# EAGLE design LDA_Board (EAGLE 7.6.0)
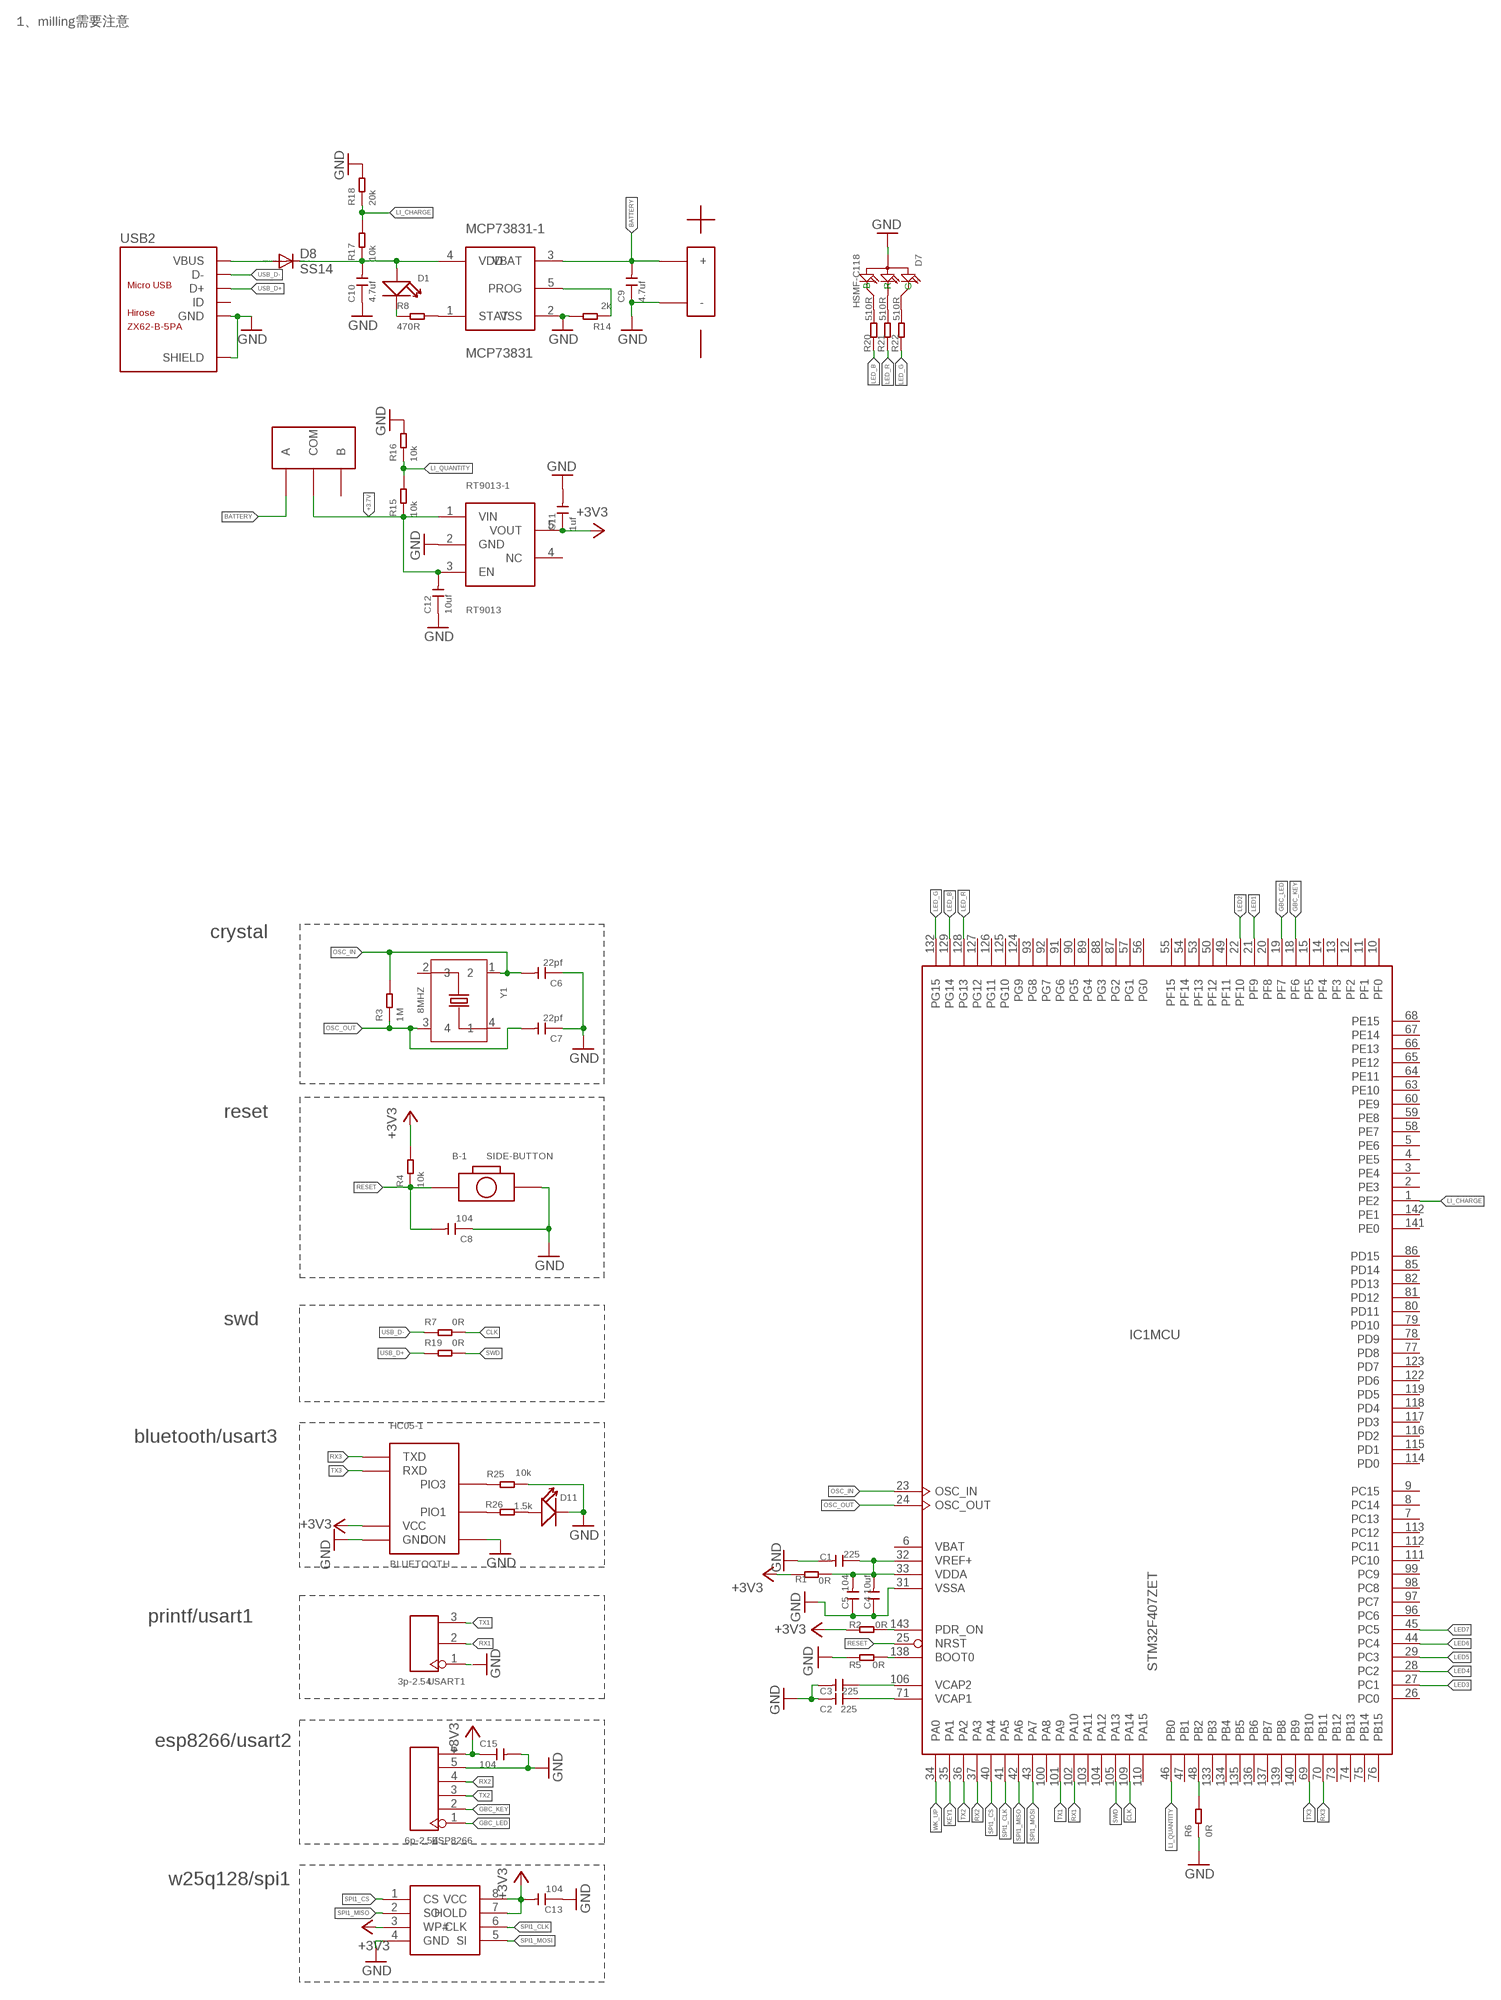
[diagram p0: schematic, sheet 1, part 1 of 2]
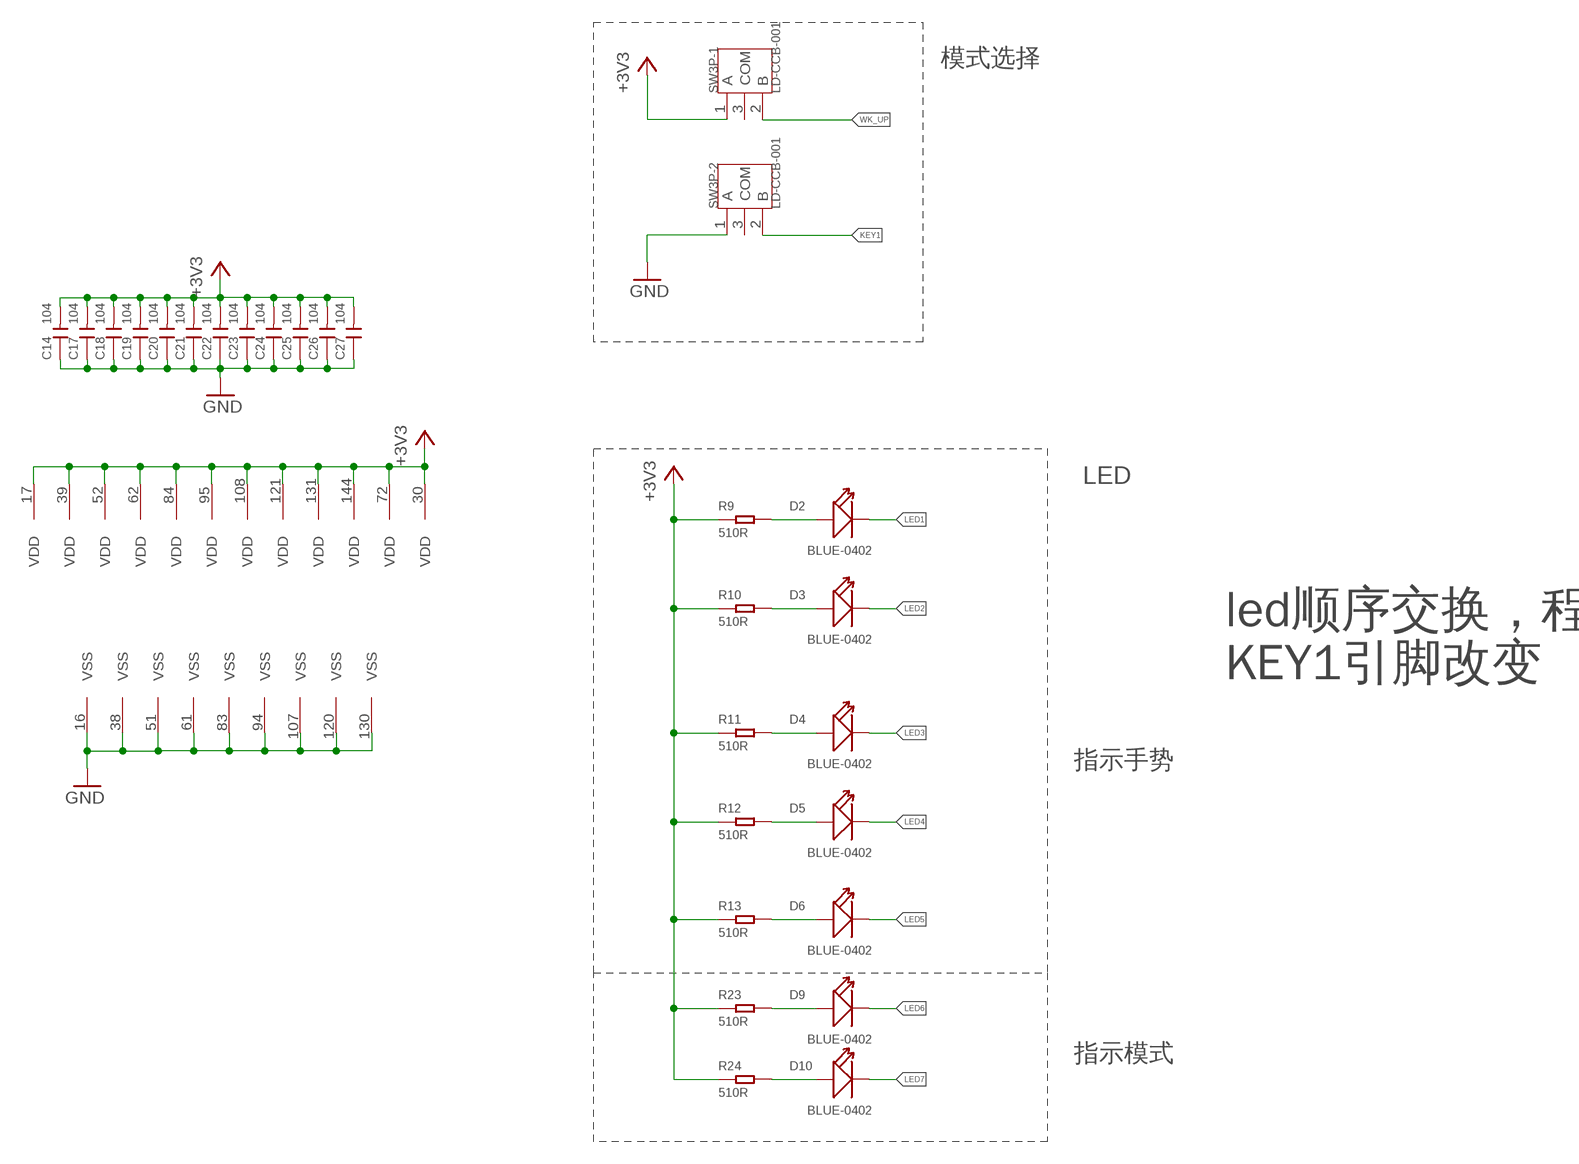
[diagram p1: schematic, sheet 1, part 2 of 2]

## Parts
B-1  SIDE-BUTTON  [SIDE-BUTTON]
BATTERY-1  BATTERY  [BATTERY]
C1  225  CAP-(0402)  [C0402]
C2  225  CAP-(0402)  [C0402]
C3  225  CAP-(0402)  [C0402]
C4  10uf  CAP-(0402)  [C0402]
C5  104  CAP-(0402)  [C0402]
C6  22pf  CAP-(0402)  [C0402]
C7  22pf  CAP-(0402)  [C0402]
C8  104  CAP-(0402)  [C0402]
C9  4.7uf  CAP-(0402)  [C0402]
C10  4.7uf  CAP-(0402)  [C0402]
C11  1uf  CAP-(0402)  [C0402]
C12  10uf  CAP-(0402)  [C0402]
C13  104  CAP-(0402)  [C0402]
C14  104  CAP-(0402)  [C0402]
C15  104  CAP-(0402)  [C0402]
C17  104  CAP-(0402)  [C0402]
C18  104  CAP-(0402)  [C0402]
C19  104  CAP-(0402)  [C0402]
C20  104  CAP-(0402)  [C0402]
C21  104  CAP-(0402)  [C0402]
C22  104  CAP-(0402)  [C0402]
C23  104  CAP-(0402)  [C0402]
C24  104  CAP-(0402)  [C0402]
C25  104  CAP-(0402)  [C0402]
C26  104  CAP-(0402)  [C0402]
C27  104  CAP-(0402)  [C0402]
D1  BLUE-0402  LED-(0402)  [LED-0402]
D2  BLUE-0402  LED-(0402)  [LED-0402]
D3  BLUE-0402  LED-(0402)  [LED-0402]
D4  BLUE-0402  LED-(0402)  [LED-0402]
D5  BLUE-0402  LED-(0402)  [LED-0402]
D6  BLUE-0402  LED-(0402)  [LED-0402]
D7  HSMF-C118  SMD-LED-RGB(4P-1210)  [LED4-SMD-1210]
D8  SS14  [SMA]
D9  BLUE-0402  LED-(0402)  [LED-0402]
D10  BLUE-0402  LED-(0402)  [LED-0402]
D11  BLUE-0402  LED-(0402)  [LED-0402]
ESP8266  6p-2.54  DIP-BLACK-FEMALE-HEADER-VERT(6P-2.54)  [H6-2.54]
HC05-1  BLUETOOTH  [BLUETOOTH]
IC1  STM32F407ZET  [LQFP144]
MCP73831-1  MCP73831  [SOT23-5]
R1  0R  RES-(0402)  [R0402]
R2  0R  RES-(0402)  [R0402]
R3  1M  RES-(0402)  [R0402]
R4  10k  RES-(0402)  [R0402]
R5  0R  RES-(0402)  [R0402]
R6  0R  RES-(0402)  [R0402]
R7  0R  RES-(0402)  [R0402]
R8  470R  RES-(0402)  [R0402]
R9  510R  RES-(0402)  [R0402]
R10  510R  RES-(0402)  [R0402]
R11  510R  RES-(0402)  [R0402]
R12  510R  RES-(0402)  [R0402]
R13  510R  RES-(0402)  [R0402]
R14  2k  RES-(0402)  [R0402]
R15  10k  RES-(0402)  [R0402]
R16  10k  RES-(0402)  [R0402]
R17  10k  RES-(0402)  [R0402]
R18  20k  RES-(0402)  [R0402]
R19  0R  RES-(0402)  [R0402]
R20  510R  RES-(0402)  [R0402]
R21  510R  RES-(0402)  [R0402]
R22  510R  RES-(0402)  [R0402]
R23  510R  RES-(0402)  [R0402]
R24  510R  RES-(0402)  [R0402]
R25  10k  RES-(0402)  [R0402]
R26  1.5k  RES-(0402)  [R0402]
RT9013-1  RT9013  [SOT23-5]
SW3P-1  LD-CCB-001  SWITCH(3P)  [SW3-2.54-9.0X3.5X3.5+2.0MM]
SW3P-2  LD-CCB-001  SWITCH(3P)  [SW3-2.54-9.0X3.5X3.5+2.0MM]
SW-1  SWITCH-3P  [SWITCH-3P]
USART1  3p-2.54  DIP-BLACK-FEMALE-HEADER-VERT(3P-2.54)  [H3-2.54]
USB2  ZX62-B-5PA  MICRO-USB-SMD(ZX62-B-5PA)  [MICRO-USB5+6P-SMD-0.65-AB]
W25Q128  W25Q128  [SOP08]
Y1  8MHZ  SMD-CRYSTAL-27.12MHZ-18PF-30PPM-60R(4P-3.2X2.5MM)  [X4-SMD-3.2X2.5X0.7MM]

## Nets
+3.7V: C12.2 R15.1 RT9013-1.1(VIN) RT9013-1.3(EN) SW-1.P$2(COM)
+3V3: C11.1 C13.2 C14.2 C15.1 C17.2 C18.2 C19.2 C20.2 C21.2 C22.2 C23.2 C24.2 C25.2 C26.2 C27.2 ESP8266.6 HC05-1.P$12(VCC) IC1.17(PWR:VDD) IC1.30(PWR:VDD) IC1.39(PWR:VDD) IC1.52(PWR:VDD) IC1.62(PWR:VDD) IC1.72(PWR:VDD) IC1.84(PWR:VDD) IC1.95(PWR:VDD) IC1.108(PWR:VDD) IC1.121(PWR:VDD) IC1.131(PWR:VDD) IC1.144(PWR:VDD) R1.1 R2.1 R4.2 R9.1 R10.1 R11.1 R12.1 R13.1 R23.1 R24.1 RT9013-1.5(VOUT) SW3P-1.1(A) W25Q128.3(WP#) W25Q128.7(HOLD) W25Q128.8(VCC)
+5V: C10.2 D1.+ D8.C MCP73831-1.4(VDD) R17.1
BATTERY: BATTERY-1.P$1(+) C9.2 MCP73831-1.3(VBAT) SW-1.P$3(A)
CLK: IC1.109(MCU:PA14) R7.2
GBC_KEY: ESP8266.2 IC1.18(MCU:PF6)
GBC_LED: ESP8266.1 IC1.19(MCU:PF7)
GND: B-1.P$1 BATTERY-1.P$2(-) C1.2 C2.2 C3.2 C4.1 C5.1 C6.1 C7.1 C8.1 C9.1 C10.1 C11.2 C12.1 C13.1 C14.1 C15.2 C17.1 C18.1 C19.1 C20.1 C21.1 C22.1 C23.1 C24.1 C25.1 C26.1 C27.1 D7.1(+) D11.- ESP8266.5 HC05-1.P$13(GND) HC05-1.P$22(CON) IC1.16(PWR:VSS) IC1.31(MCU:VSSA) IC1.38(PWR:VSS) IC1.51(PWR:VSS) IC1.61(PWR:VSS) IC1.83(PWR:VSS) IC1.94(PWR:VSS) IC1.107(PWR:VSS) IC1.120(PWR:VSS) IC1.130(PWR:VSS) MCP73831-1.2(VSS) R5.1 R6.1 R14.2 R16.2 R18.2 R25.2 RT9013-1.2(GND) SW3P-2.1(A) USART1.1 USB2.5(GND) USB2.P1(SHIELD) USB2.P2(SHIELD) USB2.P3(SHIELD) USB2.P4(SHIELD) USB2.P5(SHIELD) USB2.P6(SHIELD) W25Q128.4(GND)
KEY1: IC1.35(MCU:PA1) SW3P-2.2(B)
LED1: D2.- IC1.21(MCU:PF9)
LED2: D3.- IC1.22(MCU:PF10)
LED3: D4.- IC1.27(MCU:PC1)
LED4: D5.- IC1.28(MCU:PC2)
LED5: D6.- IC1.29(MCU:PC3)
LED6: D9.- IC1.44(MCU:PC4)
LED7: D10.- IC1.45(MCU:PC5)
LED_B: IC1.129(MCU:PG14) R20.1
LED_G: IC1.132(MCU:PG15) R22.1
LED_R: IC1.128(MCU:PG13) R21.1
LI_CHARGE: IC1.1(MCU:PE2) R17.2 R18.1
LI_QUANTITY: IC1.46(MCU:PB0) R15.2 R16.1
N$1: IC1.138(MCU:BOOT0) R5.2
N$2: C2.1 IC1.71(MCU:VCAP1)
N$3: C3.1 IC1.106(MCU:VCAP2)
N$4: IC1.48(MCU:PB2) R6.2
N$5: C1.1 C4.2 C5.2 IC1.32(MCU:VREF+) IC1.33(MCU:VDDA) R1.2
N$6: MCP73831-1.1(STAT) R8.2
N$7: IC1.143(MCU:PDR_ON) R2.2
N$8: D2.+ R9.2
N$9: D3.+ R10.2
N$10: D7.4(B) R20.2
N$11: MCP73831-1.5(PROG) R14.1
N$12: D7.2(R) R21.2
N$13: D4.+ R11.2
N$14: D5.+ R12.2
N$15: D6.+ R13.2
N$16: D1.- R8.1
N$17: HC05-1.P$26(PIO3) R25.1
N$18: D7.3(G) R22.2
N$19: HC05-1.P$24(PIO1) R26.1
N$20: D11.+ R26.2
N$24: D9.+ R23.2
N$25: D10.+ R24.2
OSC_IN: C6.2 IC1.23(MCU:OSC_IN) R3.2 Y1.1
OSC_OUT: C7.2 IC1.24(MCU:OSC_OUT) R3.1 Y1.3
RESET: B-1.P$2 C8.2 IC1.25(MCU:NRST) R4.1
RX1: IC1.102(MCU:PA10) USART1.2
RX2: ESP8266.4 IC1.37(MCU:PA3)
RX3: HC05-1.P$1(TXD) IC1.70(MCU:PB11)
SPI1_CLK: IC1.41(MCU:PA5) W25Q128.6(CLK)
SPI1_CS: IC1.40(MCU:PA4) W25Q128.1(CS)
SPI1_MISO: IC1.42(MCU:PA6) W25Q128.2(SO)
SPI1_MOSI: IC1.43(MCU:PA7) W25Q128.5(SI)
SWD: IC1.105(MCU:PA13) R19.2
TX1: IC1.101(MCU:PA9) USART1.3
TX2: ESP8266.3 IC1.36(MCU:PA2)
TX3: HC05-1.P$2(RXD) IC1.69(MCU:PB10)
USB_D+: R19.1 USB2.3(D+)
USB_D-: R7.1 USB2.2(D-)
VBUS: D8.A USB2.1(VBUS)
WK_UP: IC1.34(MCU:PA0) SW3P-1.2(B)
Unconnected: IC1.2(MCU:PE3) IC1.3(MCU:PE4) IC1.4(MCU:PE5) IC1.5(MCU:PE6) IC1.7(MCU:PC13) IC1.8(MCU:PC14) IC1.9(MCU:PC15) IC1.10(MCU:PF0) IC1.11(MCU:PF1) IC1.12(MCU:PF2) IC1.13(MCU:PF3) IC1.14(MCU:PF4) IC1.15(MCU:PF5) IC1.20(MCU:PF8) IC1.26(MCU:PC0) IC1.47(MCU:PB1) IC1.49(MCU:PF11) IC1.50(MCU:PF12) IC1.53(MCU:PF13) IC1.54(MCU:PF14) IC1.55(MCU:PF15) IC1.56(MCU:PG0) IC1.57(MCU:PG1) IC1.58(MCU:PE7) IC1.59(MCU:PE8) IC1.60(MCU:PE9) IC1.63(MCU:PE10) IC1.64(MCU:PE11) IC1.65(MCU:PE12) IC1.66(MCU:PE13) IC1.67(MCU:PE14) IC1.68(MCU:PE15) IC1.73(MCU:PB12) IC1.74(MCU:PB13) IC1.75(MCU:PB14) IC1.76(MCU:PB15) IC1.77(MCU:PD8) IC1.78(MCU:PD9) IC1.79(MCU:PD10) IC1.80(MCU:PD11) IC1.81(MCU:PD12) IC1.82(MCU:PD13) IC1.85(MCU:PD14) IC1.86(MCU:PD15) IC1.87(MCU:PG2) IC1.88(MCU:PG3) IC1.89(MCU:PG4) IC1.90(MCU:PG5) IC1.91(MCU:PG6) IC1.92(MCU:PG7) IC1.93(MCU:PG8) IC1.96(MCU:PC6) IC1.97(MCU:PC7) IC1.98(MCU:PC8) IC1.99(MCU:PC9) IC1.100(MCU:PA8) IC1.103(MCU:PA11) IC1.104(MCU:PA12) IC1.110(MCU:PA15) IC1.111(MCU:PC10) IC1.112(MCU:PC11) IC1.113(MCU:PC12) IC1.114(MCU:PD0) IC1.115(MCU:PD1) IC1.116(MCU:PD2) IC1.117(MCU:PD3) IC1.118(MCU:PD4) IC1.119(MCU:PD5) IC1.122(MCU:PD6) IC1.123(MCU:PD7) IC1.124(MCU:PG9) IC1.125(MCU:PG10) IC1.126(MCU:PG11) IC1.127(MCU:PG12) IC1.133(MCU:PB3) IC1.134(MCU:PB4) IC1.135(MCU:PB5) IC1.136(MCU:PB6) IC1.137(MCU:PB7) IC1.139(MCU:PB8) IC1.140(MCU:PB9) IC1.141(MCU:PE0) IC1.142(MCU:PE1) RT9013-1.4(NC) SW3P-1.3(COM) SW3P-2.3(COM) SW-1.P$1(B) USB2.4(ID) Y1.2 Y1.4

## Notes on the sheet
- 1、milling需要注意
- crystal
- 模式选择
- reset
- LED
- swd
- led顺序交换，程序注意
  KEY1引脚改变
- bluetooth/usart3
- 指示手势
- printf/usart1
- 指示模式
- esp8266/usart2
- w25q128/spi1

## Power pins joined to a net without a drawn wire
VBAT: IC1.6(MCU:VBAT)

## Library data of the parts
B-1 = 1-LDA_Board:SIDE-BUTTON
BATTERY-1 = 1-LDA_Board:BATTERY
C1-C15 C17-C27 = 1-LDA_Board:CAP-(0402): 302010041; MPN: GRM1555C1H150JA01D; VALUE: 15pf
D1-D6 D9-D11 = 1-LDA_Board:LED-(0402): 304090075; MPN: BL-HB337A-AV-TRB
D7 = 1-LDA_Board:SMD-LED-RGB(4P-1210): 304090035; MPN: HSMF-C118
D8 = 1-LDA_Board:SS14
ESP8266 = Seeed-OPL-Connector:DIP-BLACK-FEMALE-HEADER-VERT(6P-2.54): 320030060; MPN: F185-1106A1BSYC1
HC05-1 = 1-LDA_Board:BLUETOOTH
IC1 = 1-LDA_Board:STM32F407Z*T: ARM 32-bit Cortex™-M3 CPU 168 MHz maximum frequency 512 to 1024 Kbytes of Flash memory 192 kbytes of SRAM 114 GPIOs 1.8 to 3.6 V application supply
MCP73831-1 = 1-LDA_Board:MCP73831
R1 R2 R5-R7 R19 = 1-LDA_Board:RES-(0402): 301010000; MPN: RC0402JR-070RL
R3 R4 R8-R18 R20-R26 = 1-LDA_Board:RES-(0402): 301010000; MPN: RC0402JR-070RL; VALUE: 0R
RT9013-1 = 1-LDA_Board:RT9013
SW3P-1 SW3P-2 = 1-LDA_Board:SWITCH(3P): 311030006; MPN: LD-CCB-001
SW-1 = 1-LDA_Board:SWITCH-3P
USART1 = Seeed-OPL-Connector:DIP-BLACK-FEMALE-HEADER-VERT(3P-2.54): 320030024; MPN: F185-1103A0BSYA1
USB2 = 1-LDA_Board:MICRO-USB-SMD(ZX62-B-5PA): 320010005; MPN: ZX62-B-5PA
W25Q128 = 1-LDA_Board:W25Q128
Y1 = 1-LDA_Board:SMD-CRYSTAL-27.12MHZ-18PF-30PPM-60R(4P-3.2X2.5MM): 306010027; MPN: 7M-27.120MAAJ-T; VALUE: 27.12MHZ

## Board
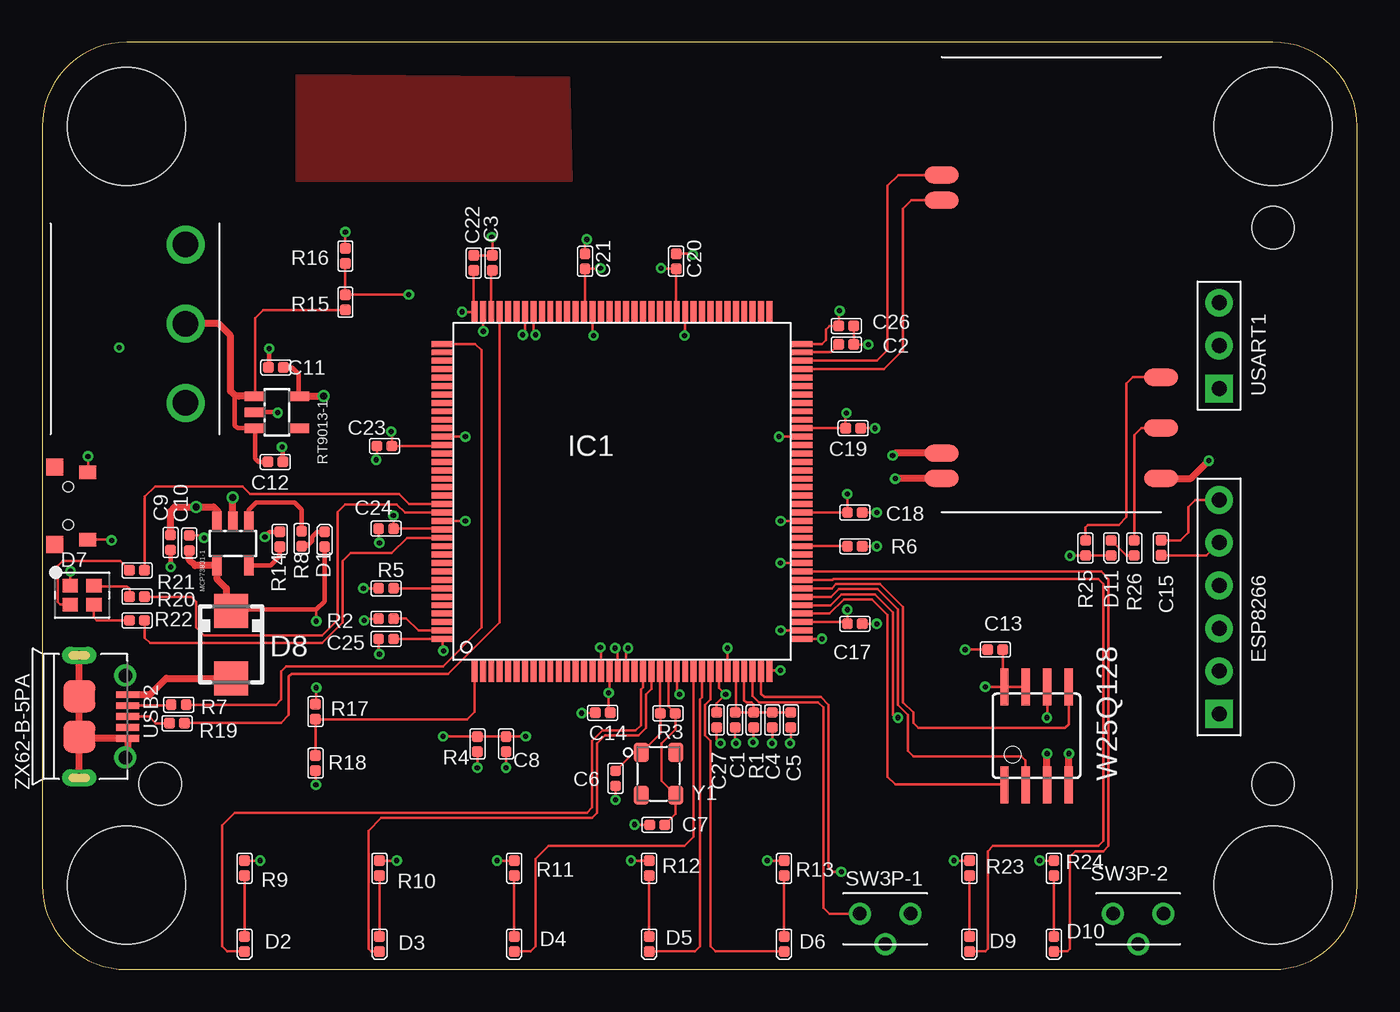
[diagram p2: board, top side]
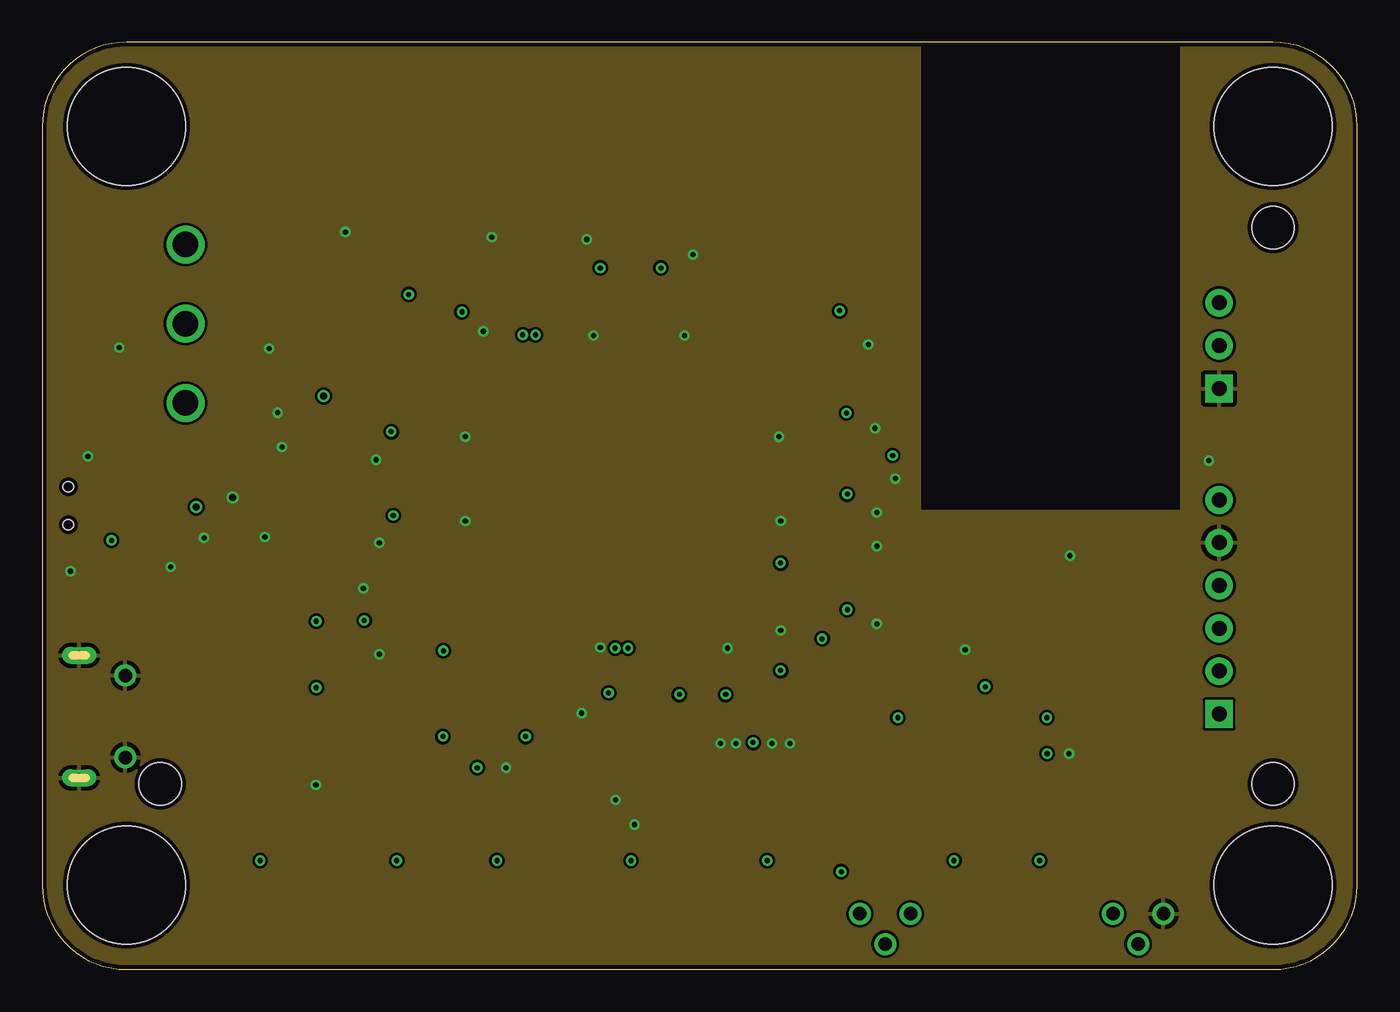
[diagram p3: board, inner layer GND]
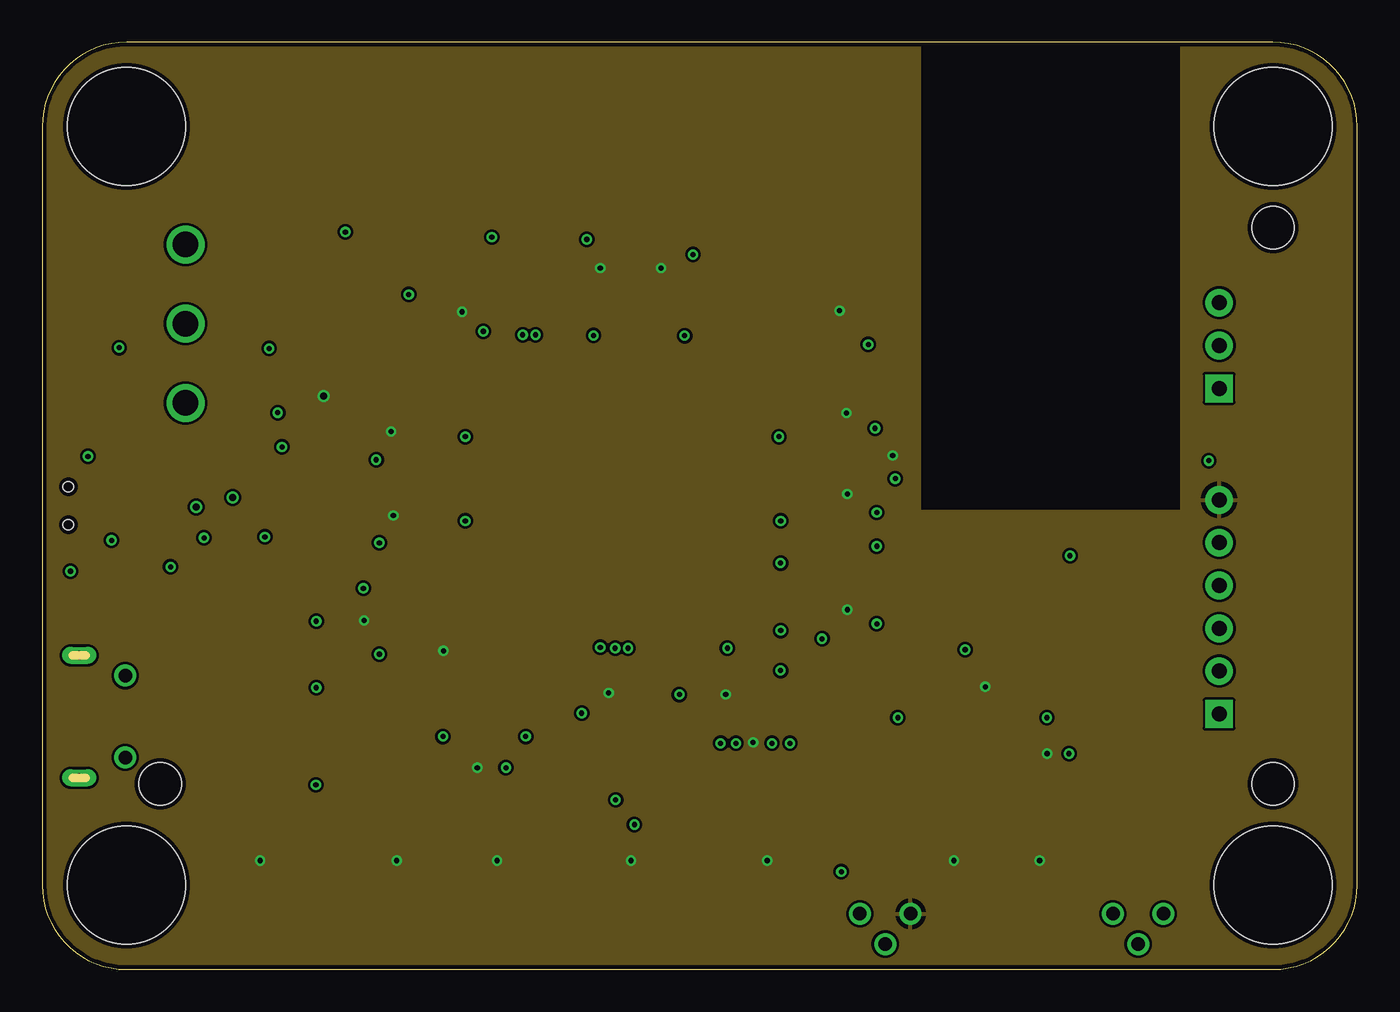
[diagram p4: board, inner layer VCC]
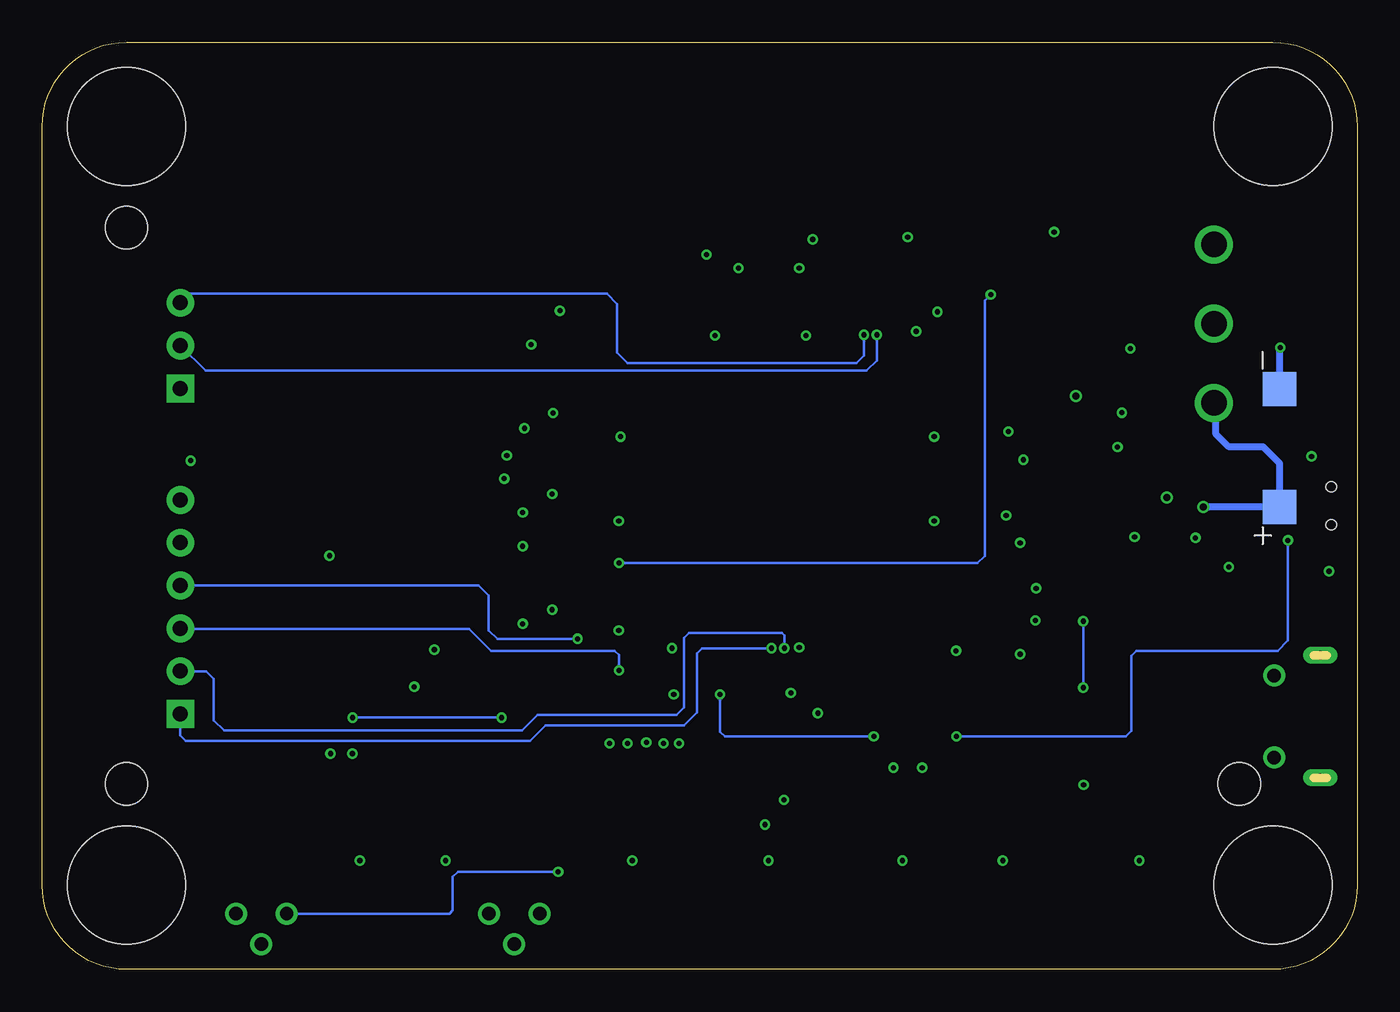
[diagram p5: board, bottom side, seen from below]

Size 78 x 55 mm. Coordinates in mm from the lower left corner, seen from the top.
Outline: 0,50 0,5 arc90 5,0 73,0 arc90 78,5 78,50 arc90 73,55 5,55 arc90 0,50
Copper layers (1*2+3*16): Top 0.035mm / dielectric 1.5mm / GND 0.035mm / dielectric 0.15mm / VCC 0.035mm / dielectric 0.2mm / Bottom 0.035mm
Design rules "default *": minimum track width 6mil, minimum drill 12mil, track to track 6mil, track to pad 6mil, pad to pad 6mil, via to via 6mil, smd to smd 6mil, copper to edge 10mil, drill to drill 8mil, minimum pad ring 10mil, minimum via ring 6mil, stop-mask expansion 4mil, vias tented up to drill 12mil, thermal gap 10mil
Holes 7 mm at 5,5 5,50 73,5 73,50
Holes 2.5 mm at 73,11 73,44 7,11

### Footprints (pad centres in the part's own frame; a part is rotated, then mirrored left to right if it is on the bottom)
SIDE-BUTTON = smd 0.8 x 1: P$1 -2,1.15; P$2 2,1.15 | smd 1 x 1: P$3 2.3,-0.8; P$4 -2.3,-0.8 | hole 0.6: 1.125,0; -1.125,0
BATTERY = smd 2 x 2: P$1 1,-1; P$2 8,-1
C0402 = smd 0.635 x 0.635: 1 0,0.445; 2 0,-0.445
LED-0402 = smd 0.635 x 0.635: + -0.445,0; - 0.445,0
LED4-SMD-1210 = smd 0.8 x 0.9: 1 -0.55,-0.7; 2 0.55,-0.7; 3 0.55,0.7; 4 -0.55,0.7
SMA = smd 2 x 2: A 2,0; C -2,0
H6-2.54 = drill 0.889 pad 1.651 square: 1 0,6.35 | drill 0.889 pad 1.651: 2 0,3.81; 3 0,1.27; 4 0,-1.27; 5 0,-3.81; 6 0,-6.35
BLUETOOTH = smd 2 x 1: P$1 0,0; P$2 0,-1.5; P$12 0,-16.5; P$13 0,-18; P$22 13,-18; P$24 13,-15; P$26 13,-12
LQFP144 = smd 0.35 x 1.35: 1 -8.75,-10.625; 2 -8.25,-10.625; 3 -7.75,-10.625; 4 -7.25,-10.625; 5 -6.75,-10.625; 6 -6.25,-10.625; 7 -5.75,-10.625; 8 -5.25,-10.625; 9 -4.75,-10.625; 10 -4.25,-10.625; 11 -3.75,-10.625; 12 -3.25,-10.625; 13 -2.75,-10.62; 14 -2.25,-10.625; 15 -1.75,-10.625; 16 -1.25,-10.625; 17 -0.75,-10.625; 18 -0.25,-10.625; 19 0.25,-10.625; 20 0.75,-10.625; 21 1.25,-10.625; 22 1.75,-10.625; 23 2.25,-10.625; 24 2.75,-10.62; 25 3.25,-10.625; 26 3.75,-10.625; 27 4.25,-10.625; 28 4.75,-10.625; 29 5.25,-10.625; 30 5.75,-10.625; 31 6.25,-10.625; 32 6.75,-10.625; 33 7.25,-10.625; 34 7.75,-10.625; 35 8.25,-10.625; 36 8.75,-10.625; 73 8.75,10.625; 74 8.25,10.625; 75 7.75,10.625; 76 7.25,10.625; 77 6.75,10.625; 78 6.25,10.625; 79 5.75,10.625; 80 5.25,10.625; 81 4.75,10.625; 82 4.25,10.625; 83 3.75,10.625; 84 3.25,10.625; 85 2.75,10.625; 86 2.25,10.625; 87 1.75,10.625; 88 1.25,10.625; 89 0.75,10.625; 90 0.25,10.625; 91 -0.25,10.625; 92 -0.75,10.625; 93 -1.25,10.625; 94 -1.75,10.625; 95 -2.25,10.625; 96 -2.75,10.625; 97 -3.25,10.625; 98 -3.75,10.625; 99 -4.25,10.625; 100 -4.75,10.625; 101 -5.25,10.625; 102 -5.75,10.625; 103 -6.25,10.625; 104 -6.75,10.625; 105 -7.25,10.625; 106 -7.75,10.625; 107 -8.25,10.625; 108 -8.75,10.625 | smd 1.35 x 0.35: 37 10.625,-8.75; 38 10.625,-8.25; 39 10.625,-7.75; 40 10.625,-7.25; 41 10.625,-6.75; 42 10.625,-6.25; 43 10.625,-5.75; 44 10.625,-5.25; 45 10.625,-4.75; 46 10.625,-4.25; 47 10.625,-3.75; 48 10.625,-3.25; 49 10.625,-2.75; 50 10.625,-2.25; 51 10.625,-1.75; 52 10.625,-1.25; 53 10.625,-0.75; 54 10.625,-0.25; 55 10.625,0.25; 56 10.625,0.75; 57 10.625,1.25; 58 10.625,1.75; 59 10.625,2.25; 60 10.625,2.75; 61 10.625,3.25; 62 10.625,3.75; 63 10.625,4.25; 64 10.625,4.75; 65 10.625,5.25; 66 10.625,5.75; 67 10.625,6.25; 68 10.625,6.75; 69 10.625,7.25; 70 10.625,7.75; 71 10.625,8.25; 72 10.625,8.75; 109 -10.625,8.75; 110 -10.625,8.25; 111 -10.625,7.75; 112 -10.625,7.25; 113 -10.625,6.75; 114 -10.625,6.25; 115 -10.625,5.75; 116 -10.625,5.25; 117 -10.625,4.75; 118 -10.625,4.25; 119 -10.625,3.75; 120 -10.625,3.25; 121 -10.625,2.75; 122 -10.625,2.25; 123 -10.625,1.75; 124 -10.625,1.25; 125 -10.625,0.75; 126 -10.625,0.25; 127 -10.625,-0.25; 128 -10.625,-0.75; 129 -10.625,-1.25; 130 -10.625,-1.75; 131 -10.625,-2.25; 132 -10.625,-2.75; 133 -10.625,-3.25; 134 -10.625,-3.75; 135 -10.625,-4.25; 136 -10.625,-4.75; 137 -10.625,-5.25; 138 -10.625,-5.75; 139 -10.625,-6.25; 140 -10.625,-6.75; 141 -10.625,-7.25; 142 -10.625,-7.75; 143 -10.625,-8.25; 144 -10.625,-8.75
SOT23-5 = smd 0.55 x 1.2: 1 -0.95,-1.3; 2 0,-1.3; 3 0.95,-1.3; 4 0.95,1.3; 5 -0.95,1.3
R0402 = smd 0.635 x 0.635: 1 0,0.445; 2 0,-0.445
SW3-2.54-9.0X3.5X3.5+2.0MM = drill 0.8 pad 1.3: 1 -1.5,-1.8; 2 1.5,-1.8 | drill 0.8: 3 0,0
SWITCH-3P = drill 1.5: P$1 -4.7,0; P$2 0,0; P$3 4.7,0
H3-2.54 = drill 0.889 pad 1.651 square: 1 0,2.54 | drill 0.889 pad 1.651: 2 0,0; 3 0,-2.54
MICRO-USB5+6P-SMD-0.65-AB = smd 0.4 x 1.35: 1 -1.3,2.875; 2 -0.65,2.875; 3 0,2.875; 4 0.65,2.875; 5 1.3,2.875 | smd 1.9 x 1.9: P1 -1.2,0; P2 1.2,0 | drill 0.508 pad 1.016 long: P3 -3.625,0; P4 3.625,0 | drill 0.8: P5 -2.425,2.73; P6 2.425,2.73
SOP08 = smd 0.5 x 2.2: 1 -1.905,-2.9; 2 -0.645,-2.9; 3 0.625,-2.9; 4 1.895,-2.9; 5 1.905,2.9; 6 0.635,2.9; 7 -0.635,2.9; 8 -1.905,2.9
X4-SMD-3.2X2.5X0.7MM = smd 1.143 x 0.889: 1 -1.27,-1.016; 2 1.27,-1.016; 3 1.27,1.016; 4 -1.27,1.016

### Placement (x,y rotation side)
B-1  1.55,27.5 270 top
BATTERY-1  5.61,26.43 90 bottom
C1  41.1,14.8 0 top
C2  47.7,37.07 90 top
C3  26.7,41.9 180 top
C4  43.3,14.8 180 top
C5  44.4,14.8 180 top
C6  34,11.33 180 top
C7  36.47,8.58 90 top
C8  27.51,13.37 180 top
C9  7.61,25.33 180 top
C10  8.73,25.29 0 top
C11  13.86,35.71 270 top
C12  13.83,30.1 270 top
C13  56.52,18.97 90 top
C14  33.24,15.22 90 top
C15  66.35,25.01 0 top
C17  48.2,20.5 270 top
C18  48.2,27.1 270 top
C19  48.1,32.1 270 top
C20  37.6,42 0 top
C21  32.2,42 0 top
C22  25.6,41.9 0 top
C23  20.3,31.05 90 top
C24  20.4,26.15 90 top
C25  20.4,19.6 90 top
C26  47.7,38.17 270 top
C27  40,14.8 180 top
D1  16.75,25.51 90 top
D2  12,1.5 270 top
D3  20,1.5 270 top
D4  28,1.5 270 top
D5  36,1.5 270 top
D6  44,1.5 270 top
D7  2.37,22.2 270 top
D8  11.21,19.26 270 top
D9  55,1.5 270 top
D10  60,1.5 270 top
D11  63.4,24.99 270 top
ESP8266  69.8,21.5 180 top
HC05-1  53.35,47.12 0 top
IC1  34.39,28.35 0 top
MCP73831-1  11.31,25.26 180 top
R1  42.2,14.8 180 top
R2  20.4,20.8 90 top
R3  37.11,15.19 270 top
R4  25.81,13.37 0 top
R5  20.4,22.6 90 top
R6  48.2,25.1 270 top
R7  8.1,15.7 90 top
R8  15.39,25.55 180 top
R9  12,6 0 top
R10  20,6 0 top
R11  28,6 0 top
R12  36,6 0 top
R13  44,6 0 top
R14  14.1,25.51 180 top
R15  17.98,39.57 180 top
R16  17.98,42.32 180 top
R17  16.21,15.29 0 top
R18  16.21,12.24 0 top
R19  8,14.6 90 top
R20  5.63,22.12 270 top
R21  5.63,23.67 270 top
R22  5.63,20.7 270 top
R23  55,6 0 top
R24  60,6 0 top
R25  61.87,24.99 0 top
R26  64.77,24.99 0 top
RT9013-1  13.92,33.05 270 top
SW3P-1  50,1.5 180 top
SW3P-2  65,1.5 180 top
SW-1  8.5,38.3 270 top
USART1  69.8,37 180 top
USB2  2.2,15 270 top
W25Q128  58.97,13.86 0 top
Y1  36.55,11.6 270 top

### Tracks (layer width: path | path; a pad name or v marks a point on that pad's centre or on a via)
+3.7V
  Top 0.152: RT9013-1.1 12.62,38.63 13.11,39.12 17.97,39.12 R15.1
  Top 0.254: C12.2 12.83,30.1 12.62,30.3 RT9013-1.3 11.59,32.1 11.43,32.26 11.43,34 11.68,34
  Top 0.406: RT9013-1.1 11.68,34 11.47,34 11.18,34.29 11.18,37.59 10.47,38.3 SW-1.P$2
+3V3  (via drill 0.3, 0.41)
  Top 0.152: 33.7,17.66 IC1.17 33.64,16.44 v33.6,16.4 33.6,15.3 C14.2 | 40.14,15.38 C27.2 40,15.77 v40.54,16.31 40.14,16.71 IC1.30 | C17.2 47.65,20.6 | 47.65,20.6 IC1.39 | IC1.52 C18.2 v47.75,28.19 | IC1.62 C19.2 47.66,32.96 v47.7,33 | C26.2 | IC1.84 37.6,39.02 C20.2 36.74,41.56 v36.7,41.6 | IC1.95 32.2,39.04 C21.2 33.06,41.56 v33.1,41.6 | IC1.121 23.71,31.05 C23.2 20.74,31.86 v20.7,31.9 | IC1.131 23.72,26.15 C24.2 20.84,26.91 v20.83,26.92 | C25.2 IC1.144 23.76,18.94 v23.8,18.9 | 47.65,20.6 47.75,20.7 v47.75,21.34 | C26.2 47.25,39.02 v47.3,39.07 | C22.2 25.6,39.02 IC1.108 24.92,38.98 v24.9,39 | R2.1 19.2,20.8 v19.1,20.7 | R1.1 42.2,13.5 v42.16,13.46 | 56.97,16.55 W25Q128.8 | R9.1 v12.92,6.44 v12.93,6.45 | R10.1 v21.02,6.44 v21.03,6.45 | R11.1 26.98,6.44 v26.98,6.45 | R12.1 34.93,6.44 v34.92,6.45 | R13.1 v43.01,6.44 v43,6.45 | R23.1 v54.08,6.44 v54.08,6.45 | R24.1 v59.16,6.44 v59.16,6.45 | ESP8266.6 68.39,27.85 67.97,27.43 67.97,25.91 67.51,25.45 C15.1 | IC1.72 46.25,37.1 46.48,37.34 46.48,37.95 46.7,38.17 C26.2 | R4.2 v25.81,11.97 v25.81,11.96 | v55.93,16.76 v55.94,16.76 W25Q128.8 | W25Q128.8 56.97,16.86 C13.2 | W25Q128.7 W25Q128.8
  Top 0.254: RT9013-1.5 15.22,35.32 14.84,35.71 C11.1
  Top 0.406: RT9013-1.5 v16.7,34 | HC05-1.P$12 50.58,30.62 v50.44,30.48 | W25Q128.3 v59.6,12.8
  pour VCC: -1.02,57.4 52.07,57.4 52.07,27.18 67.56,27.18 67.56,55.37 81.28,55.37 81.28,-2.54 -1.02,-2.54
+5V  (via drill 0.3)
  Top 0.152: 16.26,21.34 v16.26,20.65 | v16.26,16.71 16.26,15.79 R17.1
  Top 0.254: D1.+ 16.75,21.83 16.26,21.34 11.28,21.34 D8.C
  Top 0.406: D8.C 10.92,21.55 10.92,22.61 10.36,23.17 MCP73831-1.4 9.06,23.96 8.73,24.29 C10.2
  Bottom 0.152: v16.26,20.65 v16.26,16.71
BATTERY  (via drill 0.41)
  Top 0.406: MCP73831-1.3 10.41,26.61 10.41,27.18 10.16,27.43 v9.14,27.43 7.87,27.43 7.61,27.17 C9.2
  Bottom 0.406: v9.14,27.43 BATTERY-1.P$1 4.61,30.01 5.59,30.99 7.62,30.99 8.38,31.75 8.38,33.48 SW-1.P$3
CLK
  Top 0.152: IC1.109 25.69,37.1 26.06,36.73 26.06,20.27 23.77,17.98 14.48,17.98 14.17,17.68 14.17,16 13.87,15.7 R7.2
GBC_KEY  (via drill 0.3)
  Top 0.152: IC1.18 34.14,18.9 v33.98,19.05
  Bottom 0.152: v33.98,19.05 33.98,19.81 34.14,19.96 39.62,19.96 39.93,19.66 39.93,15.54 40.39,15.09 48.62,15.09 49.53,14.17 67.21,14.17 67.82,14.78 67.82,17.22 68.28,17.68 69.79,17.68 ESP8266.2
GBC_LED  (via drill 0.3)
  Top 0.152: IC1.19 34.64,18.94 v34.75,19.05
  Bottom 0.152: v34.75,19.05 38.86,19.05 39.17,18.75 39.17,15.24 39.93,14.48 48.16,14.48 49.07,13.56 69.49,13.56 69.8,13.87 ESP8266.1
GND  (via drill 0.3, 0.41)
  Top 0.152: C17.1 v49.5,20.5 | C18.1 v49.5,27.1 | C19.1 v49.4,32.1 | C26.1 C2.2 v48.99,37.07 | C20.1 38.56,42.44 v38.6,42.4 | C21.1 32.2,43.2 v32.3,43.3 | C22.1 C3.2 26.7,43.4 v26.67,43.43 | C23.1 19.86,30.27 v19.81,30.23 | C24.1 19.96,25.34 v20,25.3 | C25.1 19.96,18.74 v20,18.7 | R5.1 v19.06,22.6 v19.05,22.61 | R6.1 v49.5,25.1 | IC1.16 33.14,19.06 v33.1,19.1 | IC1.38 v43.8,20.1 | IC1.31 v40.64,19.05 | IC1.51 v43.8,26.6 | IC1.61 v43.7,31.6 | IC1.83 38.14,37.63 v38.1,37.59 | IC1.94 32.64,37.66 v32.7,37.6 | IC1.107 26.14,37.87 v26.16,37.85 | IC1.120 v25.1,31.6 | IC1.130 v25.1,26.6 | C10.1 9.46,25.74 v9.6,25.6 | D7.1 v1.67,23.62 v1.68,23.62 | C14.1 32.02,15.22 v32,15.2 | C6.1 v34,10.06 v34.01,10.06 | C7.1 35.14,8.58 v35.13,8.59 | v60.96,24.54 60.97,24.55 R25.2 D11.- | C15.2 69.06,24.57 ESP8266.5 | C8.1 v27.51,11.96 | 2.7,30.41 v2.72,30.43 2.72,29.51 B-1.P$1 | C4.1 43.3,13.43 v43.28,13.41 | C5.1 44.4,13.46 v44.35,13.41 | C1.2 41.1,13.46 v41.15,13.41 | C27.1 40,13.64 v40.23,13.41 | R16.2 v17.98,43.74 | R18.2 16.21,10.96 v16.23,10.95 | 2.3,13.7 USB2.P2 | v54.74,18.96 54.75,18.97 C13.1
  Top 0.254: C9.1 v7.61,23.88 v7.62,23.88 | R14.2 13.51,25.95 v13.21,25.65 | C12.1 14.27,30.94 v14.22,30.99 | RT9013-1.2 13.94,33.05 v13.97,33.02 | C11.2 13.46,35.75 v13.46,36.83
  Top 0.406: USB2.P6 5.08,12.72 USB2.5 2.3,13.7 | MCP73831-1.2 v11.31,27.99 v11.3,28 | HC05-1.P$22 68.13,29.12 v69.19,30.18 | HC05-1.P$13 v50.61,29.12 v50.6,29.11 | USB2.P4 USB2.P2 USB2.P1 USB2.P3 | W25Q128.4 60.9,10.96 v60.9,12.8
  Bottom 0.406: BATTERY-1.P$2 4.61,36.84 v4.57,36.88
  pour GND: -2.03,57.91 52.07,57.91 52.07,27.18 67.56,27.18 67.56,55.88 81.53,55.88 81.53,-5.84 -2.03,-5.84
KEY1  (via drill 0.3)
  Top 0.152: IC1.35 42.64,16.34 42.82,16.15 46.18,16.15 46.63,15.7 46.63,6.1 46.94,5.79 v47.4,5.79
  Bottom 0.152: v47.4,5.79 53.34,5.79 53.65,5.49 53.65,3.5 53.85,3.3 SW3P-2.2
LED1
  Top 0.152: D2.- 10.97,1.07 10.67,1.37 10.67,8.53 11.43,9.3 32.31,9.3 32.61,9.6 32.61,13.56 33.22,14.17 35.2,14.17 35.51,14.48 35.51,16.61 35.64,16.74 IC1.21
LED2
  Top 0.152: IC1.22 36.14,16.63 35.81,16.31 35.81,14.33 35.36,13.87 33.38,13.87 32.92,13.41 32.92,9.3 32.61,8.99 20.12,8.99 19.36,8.23 19.36,1.22 19.51,1.07 D3.-
LED3
  Top 0.152: IC1.27 38.64,7.85 38.1,7.32 30.02,7.32 29.26,6.55 29.26,1.37 28.96,1.07 D4.-
LED4
  Top 0.152: IC1.28 39.14,16.13 39.01,16 39.01,1.37 38.71,1.07 36.01,1.07 D5.-
LED5
  Top 0.152: IC1.29 39.64,16.02 39.32,15.7 39.32,13.87 39.62,13.56 39.62,1.37 39.93,1.07 43.99,1.07 D6.-
LED6
  Top 0.152: IC1.44 46.88,23.1 46.94,23.16 62.64,23.16 62.94,22.86 62.94,7.62 62.64,7.32 56.39,7.32 56.08,7.01 56.08,1.22 55.93,1.07 55.01,1.07 D9.-
LED7
  Top 0.152: IC1.45 62.81,23.6 63.25,23.16 63.25,7.32 62.94,7.01 61.27,7.01 60.96,6.71 60.96,1.22 60.81,1.07 60.01,1.07 D10.-
LED_B
  Top 0.152: IC1.129 21.51,27.1 21.03,27.58 17.98,27.58 17.53,27.13 17.53,20.73 16.61,19.81 9.6,19.81 9.14,20.27 9.14,21.79 8.84,22.1 6.09,22.1 R20.1
LED_G
  Top 0.152: IC1.132 21.64,25.6 20.73,24.69 18.29,24.69 17.83,24.23 17.83,20.57 16.61,19.36 6.4,19.36 6.1,19.66 6.1,20.68 R22.1
LED_R
  Top 0.152: IC1.128 21.77,27.6 21.18,28.19 12.34,28.19 11.89,28.65 6.71,28.65 6.1,28.04 6.1,23.7 R21.1
LI_CHARGE
  Top 0.152: R18.1 16.2,12.69 R17.2 16.22,14.83 25.2,14.83 25.64,15.28 IC1.1
LI_QUANTITY  (via drill 0.3)
  Top 0.152: R16.1 R15.2 18,40.03 v21.74,40.03 | IC1.46 v43.79,24.1 v43.79,24.11
  Bottom 0.152: v43.79,24.11 22.53,24.11 22.1,24.54 22.1,39.67 v21.74,40.03
N$1
  Top 0.152: IC1.138 R5.2
N$2
  Top 0.152: IC1.71 46.79,36.6 C2.1
N$3
  Top 0.152: IC1.106 26.64,41.39 C3.1
N$4
  Top 0.152: IC1.48 R6.2
N$5
  Top 0.152: IC1.32 41.14,15.28 C1.1 R1.2 | R1.2 C4.2 C5.2 | IC1.33 41.64,15.97 41.76,15.85 42.06,15.85 42.2,15.71 R1.2
N$6
  Top 0.254: MCP73831-1.1 12.26,27.25 12.7,27.69 14.99,27.69 15.39,27.28 R8.2
N$7
  Top 0.152: IC1.143 22.32,20.1 21.59,20.83 20.87,20.83 R2.2
N$8
  Top 0.152: D2.+ R9.2
N$9
  Top 0.152: D3.+ R10.2
N$10
  Top 0.152: R20.2 5.18,22.55 5.03,22.71 3.11,22.71 D7.4
N$11
  Top 0.254: MCP73831-1.5 13.54,23.96 14.1,24.51 R14.1
N$12
  Top 0.152: D7.2 1.06,21.65 0.91,21.79 0.91,23.93 1.22,24.23 4.62,24.23 R21.2
N$13
  Top 0.152: D4.+ R11.2
N$14
  Top 0.152: D5.+ R12.2
N$15
  Top 0.152: D6.+ R13.2
N$16
  Top 0.254: R8.1 15.71,25.1 16,25.4 16,25.65 16.3,25.95 D1.-
N$17
  Top 0.152: HC05-1.P$26 64.69,35.12 64.31,34.75 64.31,26.82 63.86,26.36 62.03,26.36 61.87,26.21 R25.1
N$18
  Top 0.152: R22.2 3.23,20.7 3.05,20.88 3.05,21.62 D7.3
N$19
  Top 0.152: HC05-1.P$24 65.19,32.12 64.77,31.7 R26.1
N$20
  Top 0.152: R26.2 64.29,24.55 D11.+
N$21
  pour Top: 15.09,53.04 31.24,52.88 31.39,46.79 15.09,46.79
N$24
  Top 0.152: D9.+ R23.2
N$25
  Top 0.152: D10.+ R24.2
OSC_IN
  Top 0.152: IC1.23 36.64,15.22 R3.2 36.67,14.01 Y1.1 35.1,12.87 C6.2
OSC_OUT
  Top 0.152: IC1.24 37.14,15.61 R3.1 37.56,14.24 36.73,13.41 36.73,11.17 Y1.3 37.56,9.23 C7.2
RESET  (via drill 0.3)
  Top 0.152: IC1.25 37.64,16.46 v37.8,16.31 | v28.68,13.82 C8.2 R4.1 v23.77,13.82 | v4.12,25.45 4.07,25.5 B-1.P$2
  Bottom 0.152: v37.8,16.31 37.8,14.1 37.52,13.82 v28.68,13.82 | v4.12,25.45 4.12,19.51 4.72,18.9 13.11,18.9 13.41,18.59 13.41,14.15 13.74,13.82 v23.77,13.82
RX1  (via drill 0.3)
  Top 0.152: IC1.102 28.64,37.78 v28.5,37.64
  Bottom 0.152: v28.5,37.64 28.5,36.12 29.11,35.51 68.31,35.51 USART1.2
RX2  (via drill 0.3)
  Top 0.152: IC1.37 v46.25,19.6 v46.25,19.61
  Bottom 0.152: v46.25,19.61 51,19.61 51.51,20.12 51.51,22.17 52.12,22.78 69.79,22.78 ESP8266.4
RX3
  Top 0.152: IC1.70 49.51,36.1 50.14,36.73 50.14,46.48 50.78,47.12 HC05-1.P$1
SPI1_CLK  (via drill 0.3)
  Top 0.152: IC1.41 46.75,21.6 47.4,22.25 49.38,22.25 50.44,21.18 50.44,15.09 50.6,14.94 v50.75,14.94 | 59.59,16.43 W25Q128.6 59.61,14.95 v59.59,14.94
  Bottom 0.152: v50.75,14.94 v59.59,14.94
SPI1_CS
  Top 0.152: IC1.40 46.7,21.1 47.55,21.95 49.23,21.95 50.14,21.03 50.14,11.43 50.6,10.97 57.05,10.97 W25Q128.1
SPI1_MISO
  Top 0.152: IC1.42 46.79,22.1 47.24,22.55 49.53,22.55 50.75,21.34 50.75,15.7 51.36,15.09 51.36,12.95 51.66,12.65 58.06,12.65 58.33,12.39 W25Q128.2 58.37,10.99
SPI1_MOSI
  Top 0.152: IC1.43 46.83,22.6 47.09,22.86 49.68,22.86 51.05,21.49 51.05,15.85 51.66,15.24 51.66,14.63 51.97,14.33 60.66,14.33 60.88,14.55 W25Q128.5
SWD
  Top 0.152: IC1.105 27.14,20.59 24.08,17.53 14.78,17.53 14.63,17.37 14.63,15.09 14.17,14.63 8.47,14.63 R19.2
TX1  (via drill 0.3)
  Top 0.152: IC1.101 29.14,37.77 v29.26,37.64
  Bottom 0.152: v29.26,37.64 29.26,36.42 29.72,35.97 43.28,35.97 43.89,36.58 43.89,39.47 44.5,40.08 69.26,40.08 USART1.3
TX2  (via drill 0.3)
  Top 0.152: IC1.36 v43.79,17.73
  Bottom 0.152: v43.79,17.73 43.79,18.64 44.04,18.9 51.38,18.9 52.68,20.19 69.76,20.19 ESP8266.3
TX3
  Top 0.152: IC1.69 49.93,35.6 51.05,36.73 51.05,45.11 51.56,45.62 HC05-1.P$2
USB_D+
  Top 0.152: USB2.3 6.34,15 6.74,14.6 R19.1
USB_D-
  Top 0.152: USB2.2 7.61,15.65 R7.1
VBUS
  Top 0.406: USB2.1 6.39,16.3 7.37,17.27 11.2,17.27 D8.A
WK_UP
  Top 0.152: IC1.34 42.14,16.23 42.52,15.85 46.02,15.85 46.33,15.54 46.33,3.66 46.69,3.3 SW3P-1.2

### Text on the board
tStop: ECON-TECH
Document: 蓝牙 | 电源拨码 / 开关 | 侧边 / 复位键 | 电源状态 / 指示灯 | 拓展串口、wifi | usb充电口 | 5个手势显示灯 | 训练和工作按键 / 训练和工作指示灯